# Altium project 24VRegulator.PrjPcb
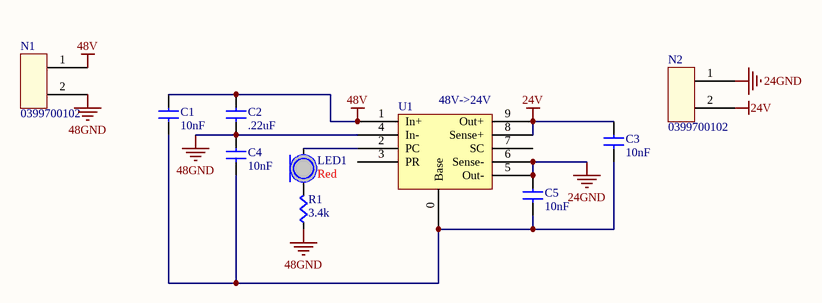
[diagram p0: 24VRegulator.SchDoc]
1 sheet, 10 parts. Net scope: global (net labels, ports and power ports of the same name join across sheets).
Board file: 24VRegulator.PcbDoc

## Sheet 24VRegulator.SchDoc
size A

### Parts
C1  value 10nF  [CAP2225]  (hidden comment: Cap)
C2  value .22uF  [CAP2225]  (hidden comment: Cap)
C3  value 10nF  [CAP2225]  (hidden comment: Cap)
C4  value 10nF  [CAP2225]  (hidden comment: Cap)
C5  value 10nF  [CAP2225]  (hidden comment: Cap)
LED1  Color: Red  [LED0603]  (hidden comment: LED)
N1  0399700102  [MOLEX-TERMINAL-1x2-EUROSTYLE-60A]
N2  0399700102  [MOLEX-TERMINAL-1x2-EUROSTYLE-60A_Reversed]
R1  value 3.4k  [RES0603]  (hidden comment: Res)
U1  48V->24V  [FASTRAK_MINI_ONBOARD_MOUNT]

### Nets
24GND: C5.1(A) N2.1 U1.5(Out-) U1.6(Sense-)
24V: C3.1(A) N2.2 U1.8(Sense+) U1.9(Out+)
48GND: C2.2(B) C4.1(A) N1.2 R1.2(B) U1.4(In-)
48V: C1.1(A) C2.1(A) N1.1 U1.1(In+)
NetC1_2: C1.2(B) C3.2(B) C4.2(B) C5.2(B) U1.0(Base)
NetLED1_A: LED1.A U1.2(PC)
NetLED1_C: LED1.C R1.1(A)

Not connected (* = marked no-connect by the designer): U1 3(PR) 7(SC)

### Library data of the parts
N1 N2 = MOLEX-TERMINAL-1x2-EUROSTYLE-60A: Giant 60A two position screw terminal; Supplier 1: Digi-Key; Supplier Part Number 1: WM3193-ND
U1 = V48B24C250BL: CONVERTER MOD DC/DC 24V 250W; Supplier 1: Digi-Key; Supplier Part Number 1: 1102-1414-ND
C1-C5 = Cap: Supplier 1: Digi-Key
  C1 C3-C5: Supplier Part Number 1: 399-7323-1-ND
  C2: Supplier Part Number 1: 399-3460-1-ND
LED1 = LED: Supplier 1: Digi-Key; Supplier Part Number 1: 754-1122-1-ND
R1 = Res: Supplier 1: Digi-Key; Supplier Part Number 1: RMCF0603FT3K40CT-ND